# Altium schematic sheet 28pins_Schematic.SchDoc (part 1 of 3)
size A2
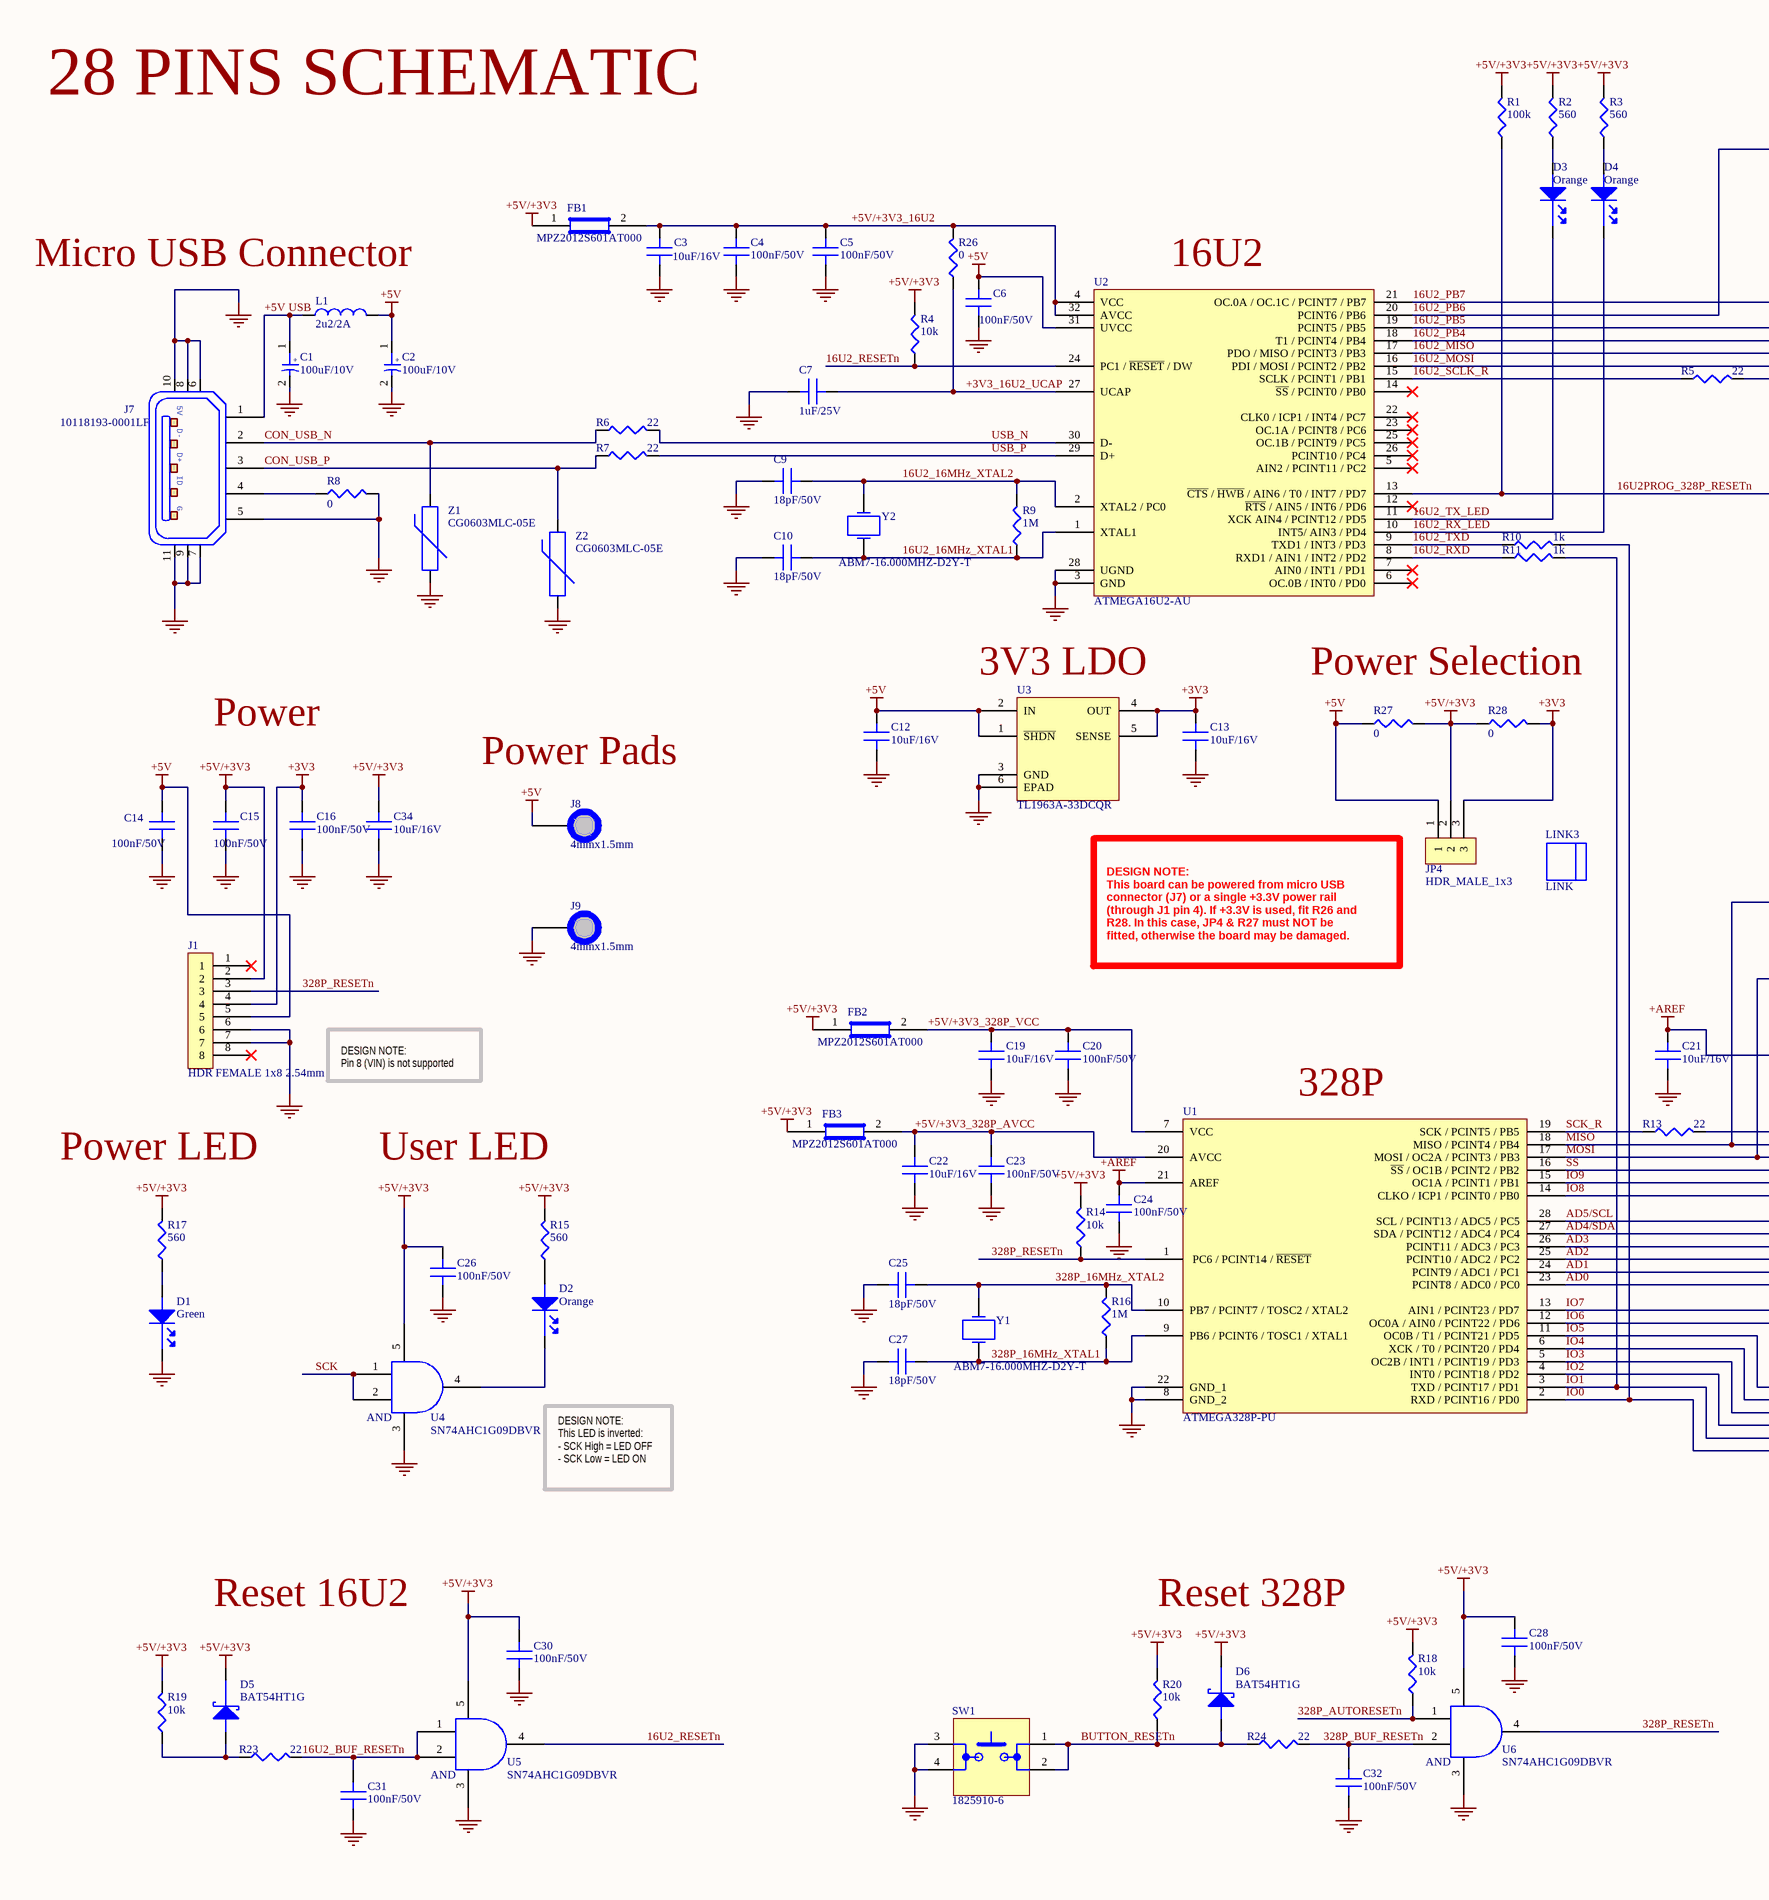
[diagram p0: 28pins_Schematic.SchDoc, left]
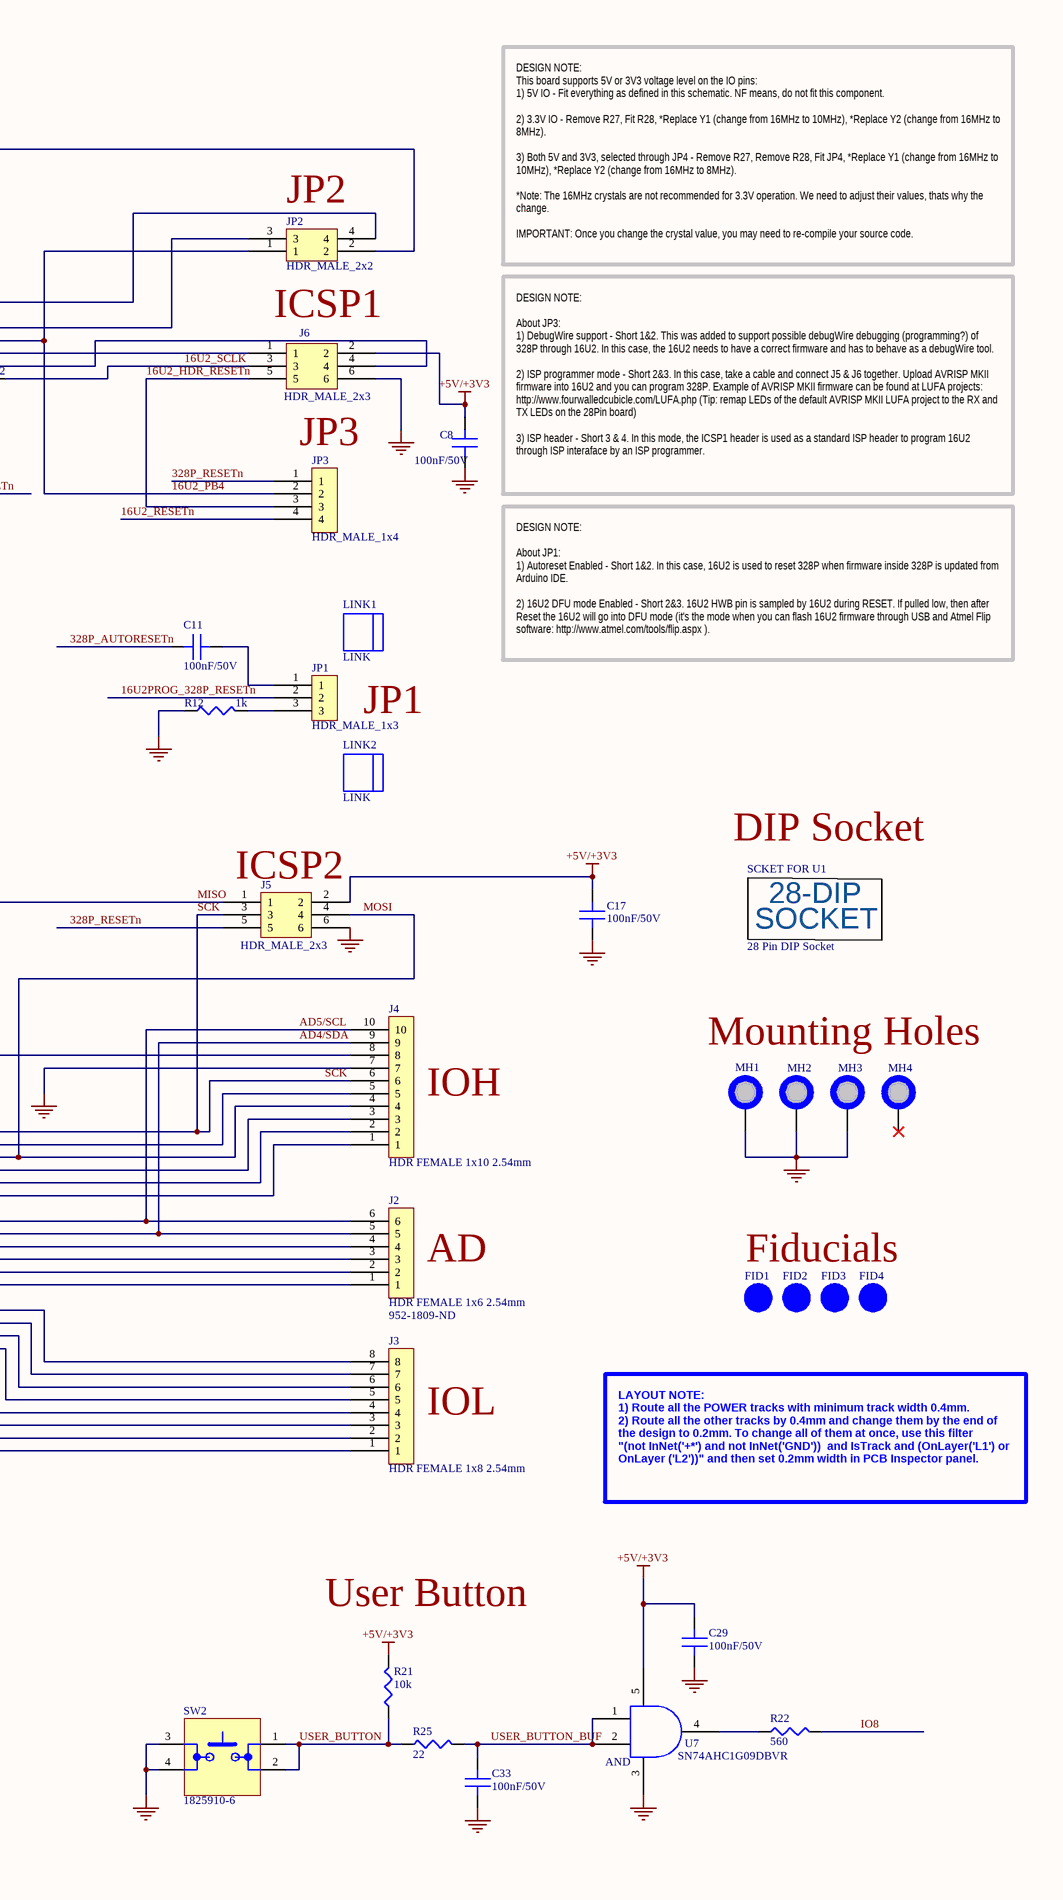
[diagram p1: 28pins_Schematic.SchDoc, right]

## Parts
C1  100uF/10V  [C_AL_C_SIZE]
C2  100uF/10V  [C_AL_C_SIZE]
C3  10uF/16V  [C0805_10uF]
C4  100nF/50V  [C0805_100nF]
C5  100nF/50V  [C0805_100nF]
C6  100nF/50V  [C0805_100nF]
C7  1uF/25V  [C0805_10uF]
C8  100nF/50V  [C0805_100nF]
C9  18pF/50V  [C0805_18pF]
C10  18pF/50V  [C0805_18pF]
C11  100nF/50V  [C0805_100nF]
C12  10uF/16V  [C0805_10uF]
C13  10uF/16V  [C0805_10uF]
C14  100nF/50V  [C0805_100nF]
C15  100nF/50V  [C0805_100nF]
C16  100nF/50V  [C0805_100nF]
C17  100nF/50V  [C0805_100nF]
C19  10uF/16V  [C0805_10uF]
C20  100nF/50V  [C0805_100nF]
C21  10uF/16V  [C0805_10uF]
C22  10uF/16V  [C0805_10uF]
C23  100nF/50V  [C0805_100nF]
C24  100nF/50V  [C0805_100nF]
C25  18pF/50V  [C0805_18pF]
C26  100nF/50V  [C0805_100nF]
C27  18pF/50V  [C0805_18pF]
C28  100nF/50V  [C0805_100nF]
C29  100nF/50V  [C0805_100nF]
C30  100nF/50V  [C0805_100nF]
C31  100nF/50V  [C0805_100nF]
C32  100nF/50V  [C0805_100nF]
C33  100nF/50V  [C0805_100nF]
C34  10uF/16V  [C0805_10uF]
D1  Green  [LED 0603]
D2  Orange  [LED 0603]
D3  Orange  [LED 0603]
D4  Orange  [LED 0603]
D5  BAT54HT1G  [SOD323]
D6  BAT54HT1G  [SOD323]
FB1  MPZ2012S601AT000  [FB_2x1.25x0.85mm]
FB2  MPZ2012S601AT000  [FB_2x1.25x0.85mm]
FB3  MPZ2012S601AT000  [FB_2x1.25x0.85mm]
FID1  FID_1mm  [FID_40mmx120mm]  (value not drawn)  (no BOM)
FID2  FID_1mm  [FID_40mmx120mm]  (value not drawn)  (no BOM)
FID3  FID_1mm  [FID_40mmx120mm]  (value not drawn)  (no BOM)
FID4  FID_1mm  [FID_40mmx120mm]  (value not drawn)  (no BOM)
J1  HDR FEMALE 1x8 2.54mm  [HDR_FEMALE_1x8_2.54mm]
J2  HDR FEMALE 1x6 2.54mm  Supplier Part Number 1: 952-1809-ND  [HDR_FEMALE_1x6_2.54mm]
J3  HDR FEMALE 1x8 2.54mm  [HDR_FEMALE_1x8_2.54mm]
J4  HDR FEMALE 1x10 2.54mm  [HDR_FEMALE_1x10_2.54mm]
J5  HDR_MALE_2x3  [HDR_MALE_2x3_2.54mm]
J6  HDR_MALE_2x3  [HDR_MALE_2x3_2.54mm]
J7  10118193-0001LF  [10118193]
J8  4mmx1.5mm  [PAD_WITH_HOLE_4mmx1.5mm]  (no BOM)
J9  4mmx1.5mm  [PAD_WITH_HOLE_4mmx1.5mm]  (no BOM)
JP1  HDR_MALE_1x3  [HDR_MALE_1x3_2.54mm]
JP2  HDR_MALE_2x2  [HDR_MALE_2x2_2.54mm]
JP3  HDR_MALE_1x4  [HDR_MALE_1x4_2.54mm]
JP4  HDR_MALE_1x3  [HDR_MALE_1x3_2.54mm]
L1  2u2/2A  [C1210_Inductor]
LINK1  LINK  (mechanical)
LINK2  LINK  (mechanical)
LINK3  LINK  (mechanical)
MH1  MH_7.4MMC_3.2MMD  [MH_7.4MMD_3.2MMC]  (value not drawn)  (no BOM)
MH2  MH_7.4MMC_3.2MMD  [MH_7.4MMD_3.2MMC]  (value not drawn)  (no BOM)
MH3  MH_7.4MMC_3.2MMD  [MH_7.4MMD_3.2MMC]  (value not drawn)  (no BOM)
MH4  MH_7.4MMC_3.2MMD_NON_PLATED  [MH_7.4MMC_3.2MMD_NON_PLATED]  (value not drawn)  (no BOM)
R1  100k  [R0805]
R2  560  [R0805]
R3  560  [R0805]
R4  10k  [R0805]
R5  22  [R0805]
R6  22  [R0805]
R7  22  [R0805]
R8  0  [R0805]
R9  1M  [R0805]
R10  1k  [R0805]
R11  1k  [R0805]
R12  1k  [R0805]
R13  22  [R0805]
R14  10k  [R0805]
R15  560  [R0805]
R16  1M  [R0805]
R17  560  [R0805]
R18  10k  [R0805]
R19  10k  [R0805]
R20  10k  [R0805]
R21  10k  [R0805]
R22  560  [R0805]
R23  22  [R0805]
R24  22  [R0805]
R25  22  [R0805]
R26  0  [R0805]
R27  0  [R0805]
R28  0  [R0805]
SCKET_FOR_U1  28 Pin DIP Socket  [28_DIP_7.62mm_SOCKET]
SW1  1825910-6  [1825810-6_TACT_SWITCH]
SW2  1825910-6  [1825810-6_TACT_SWITCH]
U1  ATMEGA328P-PU  [DIP28_7.62mm]
U2  ATMEGA16U2-AU  [TQFP32]
U3  TL1963A-33DCQR  [GCQ (R-PDSO-G6)]
U4  SN74AHC1G09DBVR  [DBV_SOT_23_5]
U5  SN74AHC1G09DBVR  [DBV_SOT_23_5]
U6  SN74AHC1G09DBVR  [DBV_SOT_23_5]
U7  SN74AHC1G09DBVR  [DBV_SOT_23_5]
Y1  ABM7-16.000MHZ-D2Y-T  [ABM7_v1_1_BIG]
Y2  ABM7-16.000MHZ-D2Y-T  [ABM7_v1_1_BIG]
Z1  CG0603MLC-05E  [R0603]
Z2  CG0603MLC-05E  [R0603]

## Nets
+3V3: C13.2 C16.2 J1.4 JP4.3 R28.2 U3.4(OUT) U3.5(SENSE)
+5V: C2.1 C6.2 C12.2 C14.1 J1.5 J8.1 JP4.1 L1.2 R27.1 U2.31(UVCC) U3.1(~{SHDN}) U3.2(IN)
+5V/+3V3: C8.2 C15.2 C17.2 C26.2 C28.2 C29.2 C30.2 C34.2 D5.1(Cathode) D6.1(Cathode) FB1.1 FB2.1 FB3.1 J1.2 J5.2 J6.2 JP4.2 R1.2 R2.2 R3.2 R4.2 R14.2 R15.2 R17.2 R18.2 R19.2 R20.2 R21.2 R27.2 R28.1 U4.5 U5.5 U6.5 U7.5
+AREF: C21.2 C24.2 J4.8 U1.21(AREF)
GND: C1.2 C2.2 C3.1 C4.1 C5.1 C6.1 C7.1 C8.1 C9.1 C10.1 C12.1 C13.1 C14.2 C15.1 C16.1 C17.1 C19.1 C20.1 C21.1 C22.1 C23.1 C24.1 C25.1 C26.1 C27.1 C28.1 C29.1 C30.1 C31.1 C32.1 C33.1 C34.1 D1.1(Cathode) J1.6 J1.7 J4.7 J5.6 J6.6 J7.5 J7.6 J7.7 J7.8 J7.9 J7.10 J7.11 J9.1 MH1.1 MH2.1 MH3.1 R8.2 R12.1 SW1.3 SW1.4 SW2.3 SW2.4 U1.8(GND_2) U1.22(GND_1) U2.3(GND) U2.28(UGND) U3.3(GND) U3.6(EPAD) U4.3 U5.3 U6.3 U7.3 Z1.1 Z2.1
16U2_16MHz_XTAL1: C10.2 R9.1 U2.1(XTAL1) Y2.1
16U2_16MHz_XTAL2: C9.2 R9.2 U2.2(XTAL2_/_PC0) Y2.2
16U2_BUF_RESETn: C31.2 R23.2 U5.1 U5.2
16U2_HDR_RESETn: J6.5 JP3.3
16U2_MISO: J6.1 U2.17(PDO_/_MISO_/_PCINT3_/_PB3)
16U2_MOSI: J6.4 U2.16(PDI_/_MOSI_/_PCINT2_/_PB2)
16U2_PB4: JP2.1 JP3.2 U2.18(T1_/_PCINT4_/_PB4)
16U2_PB5: JP2.3 U2.19(PCINT5_/_PB5)
16U2_PB6: JP2.2 U2.20(PCINT6_/_PB6)
16U2_PB7: JP2.4 U2.21(OC.0A_/_OC.1C_/_PCINT7_/_PB7)
16U2_RESETn: JP3.4 R4.1 U2.24(PC1_/_~{RESET}_/_DW) U5.4
16U2_RX_LED: D4.1(Cathode) U2.10(INT5/_AIN3_/_PD4)
16U2_RXD: R11.1 U2.8(RXD1_/_AIN1_/_INT2_/_PD2)
16U2_SCLK: J6.3 R5.2
16U2_SCLK_R: R5.1 U2.15(SCLK_/_PCINT1_/_PB1)
16U2_TX_LED: D3.1(Cathode) U2.11(XCK_AIN4_/_PCINT12_/_PD5)
16U2_TXD: R10.1 U2.9(TXD1_/_INT3_/_PD3)
16U2PROG_328P_RESETn: JP1.2 R1.1 U2.13(~{CTS}_/_~{HWB}_/_AIN6_/_T0_/_INT7_/_PD7)
328P_16MHz_XTAL1: C27.2 R16.1 U1.9(PB6_/_PCINT6_/_TOSC1_/_XTAL1) Y1.1
328P_16MHz_XTAL2: C25.2 R16.2 U1.10(PB7_/_PCINT7_/_TOSC2_/_XTAL2) Y1.2
328P_AUTORESETn: C11.1 R18.1 U6.1
328P_BUF_RESETn: C32.2 R24.2 U6.2
328P_RESETn: J1.3 J5.5 JP3.1 R14.1 U1.1(PC6_/_PCINT14_/_~{RESET}) U6.4
+3V3_16U2_UCAP: C7.2 R26.1 U2.27(UCAP)
+5V USB: C1.1 J7.1 L1.1
+5V/+3V3_16U2: C3.2 C4.2 C5.2 FB1.2 R26.2 U2.4(VCC) U2.32(AVCC)
+5V/+3V3_328P_AVCC: C22.2 C23.2 FB3.2 U1.20(AVCC)
+5V/+3V3_328P_VCC: C19.2 C20.2 FB2.2 U1.7(VCC)
AD0: J2.1 U1.23(PCINT8_/_ADC0_/_PC0)
AD1: J2.2 U1.24(PCINT9_/_ADC1_/_PC1)
AD2: J2.3 U1.25(PCINT10_/_ADC2_/_PC2)
AD3: J2.4 U1.26(PCINT11_/_ADC3_/_PC3)
AD4/SDA: J2.5 J4.9 U1.27(SDA_/_PCINT12_/_ADC4_/_PC4)
AD5/SCL: J2.6 J4.10 U1.28(SCL_/_PCINT13_/_ADC5_/_PC5)
BUTTON_RESETn: D6.2(Anode) R20.1 R24.1 SW1.1 SW1.2
CON_USB_N: J7.2 R6.1 Z1.2
CON_USB_P: J7.3 R7.1 Z2.2
IO0: J3.1 R10.2 U1.2(RXD_/_PCINT16_/_PD0)
IO1: J3.2 R11.2 U1.3(TXD_/_PCINT17_/_PD1)
IO2: J3.3 U1.4(INT0_/_PCINT18_/_PD2)
IO3: J3.4 U1.5(OC2B_/_INT1_/_PCINT19_/_PD3)
IO4: J3.5 U1.6(XCK_/_T0_/_PCINT20_/_PD4)
IO5: J3.6 U1.11(OC0B_/_T1_/_PCINT21_/_PD5)
IO6: J3.7 U1.12(OC0A_/_AIN0_/_PCINT22_/_PD6)
IO7: J3.8 U1.13(AIN1_/_PCINT23_/_PD7)
IO8: J4.1 R22.2 U1.14(CLKO_/_ICP1_/_PCINT0_/_PB0)
IO9: J4.2 U1.15(OC1A_/_PCINT1_/_PB1)
MISO: J4.5 J5.1 U1.18(MISO_/_PCINT4_/_PB4)
MOSI: J4.4 J5.4 U1.17(MOSI_/_OC2A_/_PCINT3_/_PB3)
SCK: J4.6 J5.3 R13.2 U4.1 U4.2
SCK_R: R13.1 U1.19(SCK_/_PCINT5_/_PB5)
SS: J4.3 U1.16(~{SS}_/_OC1B_/_PCINT2_/_PB2)
USB_N: R6.2 U2.30(D-)
USB_P: R7.2 U2.29(D+)
USER_BUTTON: R21.1 R25.1 SW2.1 SW2.2
USER_BUTTON_BUF: C33.2 R25.2 U7.1 U7.2
NetC11_2: C11.2 JP1.1
NetD1_2: D1.2(Anode) R17.1
NetD2_1: D2.1(Cathode) U4.4
NetD2_2: D2.2(Anode) R15.1
NetD3_2: D3.2(Anode) R2.1
NetD4_2: D4.2(Anode) R3.1
NetD5_2: D5.2(Anode) R19.1 R23.1
NetJ7_4: J7.4 R8.1
NetJP1_3: JP1.3 R12.2
NetR22_1: R22.1 U7.4

Not connected (* = marked no-connect by the designer): J1 1* 8*; MH4 1*; U2 5(AIN2_/_PCINT11_/_PC2)* 6(OC.0B_/_INT0_/_PD0)* 7(AIN0_/_INT1_/_PD1)* 12(~{RTS}_/_AIN5_/_INT6_/_PD6)* 14(~{SS}_/_PCINT0_/_PB0)* 22(CLK0_/_ICP1_/_INT4_/_PC7)* 23(OC.1A_/_PCINT8_/_PC6)* 25(OC.1B_/_PCINT9_/_PC5)* 26(PCINT10_/_PC4)*

## Notes on the sheet
- 28 PINS SCHEMATIC
- (near JP2) JP2
- (near L1) Micro USB Connector
- (near U2) 16U2
- DESIGN NOTE:
  This board supports 5V or 3V3 voltage level on the IO pins:
  1) 5V IO - Fit everything as defined in this schematic. NF means, do not fit this component.
  2) 3.3V IO - Remove R27, Fit R28, *Replace Y1 (change from 16MHz to 10MHz), *Replace Y2 (change from 16MHz to 8MHz).
  3) Both 5V and 3V3, selected through JP4 - Remove R27, Remove R28, Fit JP4, *Replace Y1 (change from 16MHz to 10MHz), *Replace Y2 (change from 16MHz to 8MHz).
  *Note: The 16MHz crystals are not recommended for 3.3V operation. We need to adjust their values, thats why the change.
  IMPORTANT: Once you change the crystal value, you may need to re-compile your source code.
- ICSP1
- JP3
- DESIGN NOTE:
  About JP3:
  1) DebugWire support - Short 1&2. This was added to support possible debugWire debugging (programming?) of 328P through 16U2. In this case, the 16U2 needs to have a correct firmware and has to behave as a debugWire tool.
  2) ISP programmer mode - Short 2&3. In this case, take a cable and connect J5 & J6 together. Upload AVRISP MKII firmware into 16U2 and you can program 328P. Example of AVRISP MKII firmware can be found at LUFA projects: http://www.fourwalledcubicle.com/LUFA.php (Tip: remap LEDs of the default AVRISP MKII LUFA project to the RX and TX LEDs on the 28Pin board)
  3) ISP header - Short 3 & 4. In this mode, the ICSP1 header is used as a standard ISP header to program 16U2 through ISP interaface by an ISP programmer.
- DESIGN NOTE:
  About JP1:
  1) Autoreset Enabled - Short 1&2. In this case, 16U2 is used to reset 328P when firmware inside 328P is updated from Arduino IDE.
  2) 16U2 DFU mode Enabled - Short 2&3. 16U2 HWB pin is sampled by 16U2 during RESET. If pulled low, then after Reset the 16U2 will go into DFU mode (it's the mode when you can flash 16U2 firmware through USB and Atmel Flip software: http://www.atmel.com/tools/flip.aspx ).
- (near U3) 3V3 LDO
- Power Selection
- JP1
- Power
- Power Pads
- DIP Socket
- (near J5) ICSP2
- DESIGN NOTE:
  This board can be powered from micro USB connector (J7) or a single +3.3V power rail (through J1 pin 4). If +3.3V is used, fit R26 and R28. In this case, JP4 & R27 must NOT be fitted, otherwise the board may be damaged.
- DESIGN NOTE:
  Pin 8 (VIN) is not supported
- (near U1) 328P
- (near J4) IOH
- Mounting Holes
- Power LED
- User LED
- (near J2) AD
- Fiducials
- (near J3) IOL
- DESIGN NOTE:
  This LED is inverted:
  - SCK High = LED OFF
  - SCK Low = LED ON
- LAYOUT NOTE:
  1) Route all the POWER tracks with minimum track width 0.4mm.
  2) Route all the other tracks by 0.4mm and change them by the end of the design to 0.2mm. To change all of them at once, use this filter
  "(not InNet('+*') and not InNet('GND'))  and IsTrack and (OnLayer('L1') or OnLayer ('L2'))" and then set 0.2mm width in PCB Inspector panel.
- Reset 16U2
- Reset 328P
- User Button
- (in symbol 4828-3004-CP) 28-DIP; SOCKET
- (in symbol 10118193-0001LF) 5V; D-; D+; ID; G
- (in symbol EEE-1AA101WR) +